# Altium schematic sheet Sheet2.SchDoc
size A; SheetNumber: 1; SheetTotal: 1
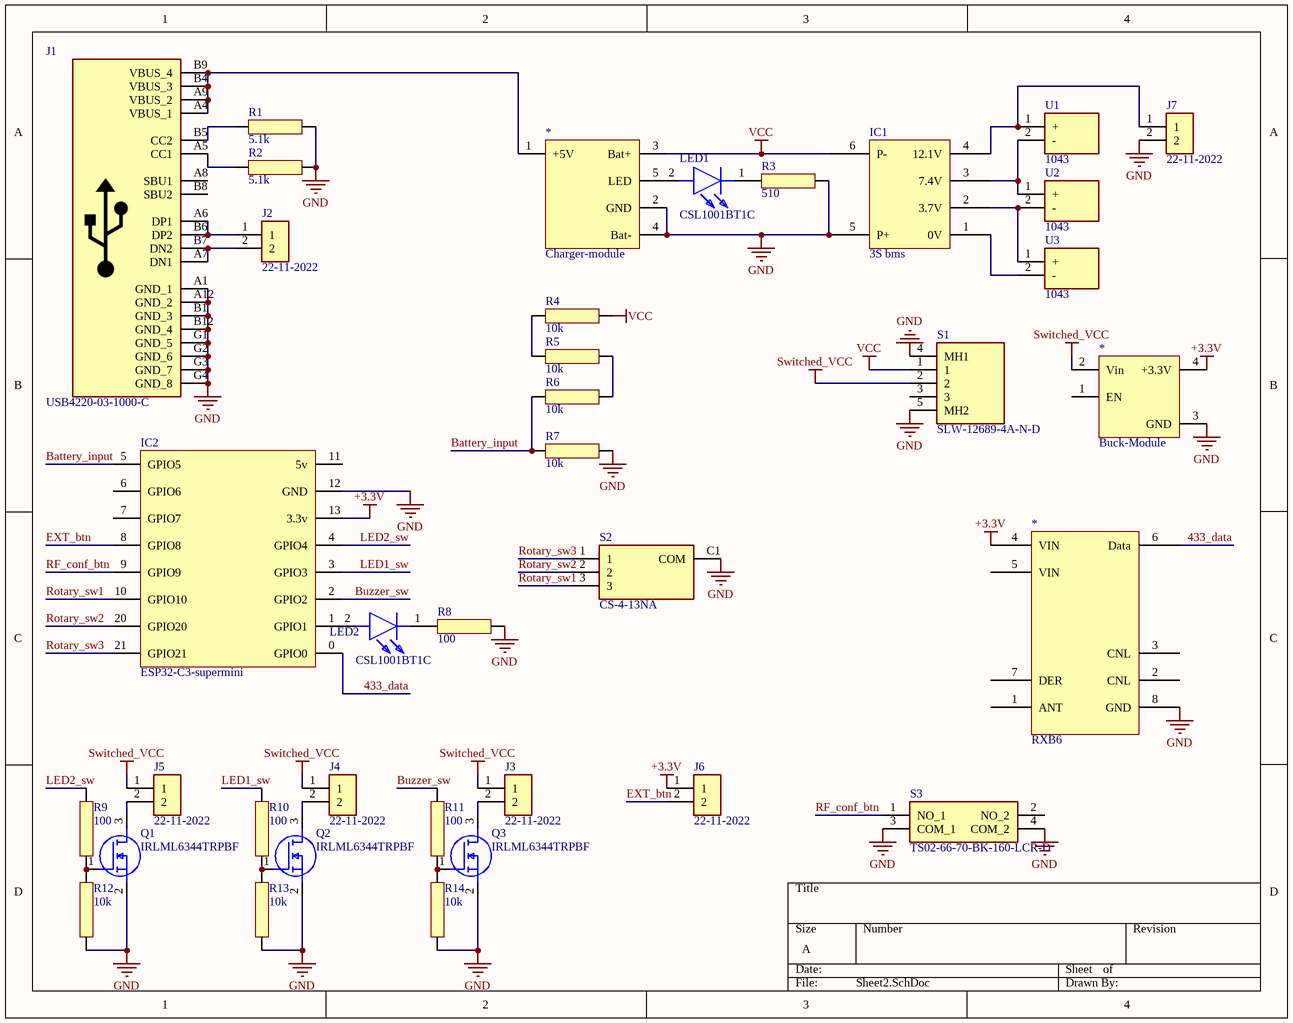
[diagram p0: Sheet2.SchDoc]

## Parts
(Parts that share a designator on the sheet are numbered #1, #2 ... from top to bottom, then left to right.)
*#1  Charger-module  [Charger-module]
*#2  Buck-Module  [Buck-Module]
*#3  RXB6  [RXB6]
IC1  3S bms  [3S BMS]
IC2  ESP32-C3-supermini  [Esp32Module]
J1  USB4220-03-1000-C  [USB4220031000C]
J2  22-11-2022  [22112022]
J3  22-11-2022  [22112022]
J4  22-11-2022  [22112022]
J5  22-11-2022  [22112022]
J6  22-11-2022  [22112022]
J7  22-11-2022  [22112022]
LED1  CSL1001BT1C  [CSL1001BT1C]
LED2  CSL1001BT1C  [CSL1001BT1C]
Q1  IRLML6344TRPBF  [SOT95P237X112-3N]
Q2  IRLML6344TRPBF  [SOT95P237X112-3N]
Q3  IRLML6344TRPBF  [SOT95P237X112-3N]
R1  5.1k  [Resistor]
R2  5.1k  [Resistor]
R3  510  [Resistor]
R4  10k  [Resistor]
R5  10k  [Resistor]
R6  10k  [Resistor]
R7  10k  [Resistor]
R8  100  [Resistor]
R9  100  [Resistor]
R10  100  [Resistor]
R11  100  [Resistor]
R12  10k  [Resistor]
R13  10k  [Resistor]
R14  10k  [Resistor]
S1  SLW-12689-4A-N-D  [SLW126894AND]
S2  CS-4-13NA  [CS413NA]
S3  TS02-66-70-BK-160-LCR-D  [TS026670BK160LCRD]
U1  1043  [1043]
U2  1043  [1043]
U3  1043  [1043]

## Nets
+3.3V: *#2.4(+3.3V) *#3.4(VIN) IC2.13(3.3v) J6.1
GND: *#1.2(GND) *#1.4(Bat-) *#2.3(GND) *#3.8(GND) IC1.5(P+) IC2.12(GND) J1.A1(GND_1) J1.A12(GND_2) J1.B1(GND_3) J1.B12(GND_4) J1.G1(GND_5) J1.G2(GND_6) J1.G3(GND_7) J1.G4(GND_8) J7.2 Q1.2(S) Q2.2(S) Q3.2(S) R1.2 R2.2 R3.1 R7.2 R8.1 R12.1 R13.1 R14.1 S1.4(MH1) S1.5(MH2) S2.C1(COM) S3.3(COM_1) S3.4(COM_2)
Switched_VCC: *#2.2(Vin) J3.1 J4.1 J5.1 S1.2
VCC: *#1.3(Bat+) IC1.6(P-) R4.2 S1.1
433_data: *#3.6(Data) IC2.0(GPIO0)
Battery_input: IC2.5(GPIO5) R6.1 R7.1
Buzzer_sw: IC2.2(GPIO2) R11.2
EXT_btn: IC2.8(GPIO8) J6.2
LED1_sw: IC2.3(GPIO3) R10.2
LED2_sw: IC2.4(GPIO4) R9.2
RF_conf_btn: IC2.9(GPIO9) S3.1(NO_1)
Rotary_sw1: IC2.10(GPIO10) S2.3
Rotary_sw2: IC2.20(GPIO20) S2.2
Rotary_sw3: IC2.21(GPIO21) S2.1
Net*#1_1: *#1.1(+5V) J1.A4(VBUS_1) J1.A9(VBUS_2) J1.B4(VBUS_3) J1.B9(VBUS_4)
Net*#1_5: *#1.5(LED) LED1.2(A)
NetIC1_1: IC1.1(0V) U3.2(-)
NetIC1_2: IC1.2(3.7V) U2.2(-) U3.1(+)
NetIC1_3: IC1.3(7.4V) U1.2(-) U2.1(+)
NetIC1_4: IC1.4(12.1V) J7.1 U1.1(+)
NetIC2_1: IC2.1(GPIO1) LED2.2(A)
NetJ1_A5: J1.A5(CC1) R2.1
NetJ1_A6: J1.A6(DP1) J1.B6(DP2) J2.1
NetJ1_A7: J1.A7(DN1) J1.B7(DN2) J2.2
NetJ1_B5: J1.B5(CC2) R1.1
NetJ3_2: J3.2 Q3.3(D)
NetJ4_2: J4.2 Q2.3(D)
NetJ5_2: J5.2 Q1.3(D)
NetLED1_1: LED1.1(K) R3.2
NetLED2_1: LED2.1(K) R8.2
NetQ1_1: Q1.1(G) R9.1 R12.2
NetQ2_1: Q2.1(G) R10.1 R13.2
NetQ3_1: Q3.1(G) R11.1 R14.2
NetR4_1: R4.1 R5.1
NetR5_2: R5.2 R6.2

Not connected (* = marked no-connect by the designer): *#2 1(EN); *#3 1(ANT) 2(CNL) 3(CNL) 5(VIN) 7(DER); IC2 6(GPIO6) 7(GPIO7) 11(5v); J1 A8(SBU1) B8(SBU2); S1 3; S3 2(NO_2)

## Library data of the parts
J1 = USB4220-03-1000-C: Connector; Manufacturer_Name: GCT (GLOBAL CONNECTOR TECHNOLOGY); Datasheet Link: https://gct.co/download?type=PDFDrawing&name=USB4220.pdf; Height: 10.25mm; Manufacturer_Part_Number: USB4220-03-1000-C; Mouser Part Number: 640-USB4220031000C; Mouser Price/Stock: https://www.mouser.co.uk/ProductDetail/GCT/USB4220-03-1000-C?qs=iLKYxzqNS75fs1QrHcx%2FlA%3D%3D
J2-J7 = 22-11-2022: Connector; Manufacturer_Name: Molex; Datasheet Link: https://www.molex.com/en-us/products/part-detail/22112022?display=pdf; Height: 10.92mm; Manufacturer_Part_Number: 22-11-2022; Mouser Part Number: 538-22-11-2022; Mouser Price/Stock: https://www.mouser.co.uk/ProductDetail/Molex/22-11-2022?qs=mrPiglD9aYLq1NGrfjXTJg%3D%3D; Arrow Part Number: 22-11-2022; Arrow Price/Stock: https://www.arrow.com/en/products/22-11-2022/molex?utm_currency=USD&region=nac
LED1 LED2 = CSL1001BT1C: LED; Manufacturer_Name: ROHM Semiconductor; Datasheet Link: https://fscdn.rohm.com/en/products/databook/datasheet/opto/led/chip_mono/csl1001bt1(c)-e.pdf; Height: 1.16mm; Manufacturer_Part_Number: CSL1001BT1C; Mouser Part Number: 755-CSL1001BT1C; Mouser Price/Stock: https://www.mouser.co.uk/ProductDetail/ROHM-Semiconductor/CSL1001BT1C?qs=HoCaDK9Nz5fqNTX3Pg0ReA%3D%3D
Q1-Q3 = IRLML6344TRPBF: MOSFET (N-Channel); Manufacturer_Name: Infineon; Datasheet Link: https://www.infineon.com/dgdl/irlml6344pbf.pdf?fileId=5546d462533600a4015356689c44262c; Height: 1.12mm; Manufacturer_Part_Number: IRLML6344TRPBF; Mouser Part Number: 942-IRLML6344TRPBF; Mouser Price/Stock: https://www.mouser.co.uk/ProductDetail/Infineon-Technologies/IRLML6344TRPBF?qs=9%252BKlkBgLFf2w4qS48UOXVw%3D%3D; Arrow Part Number: IRLML6344TRPBF; Arrow Price/Stock: https://www.arrow.com/en/products/irlml6344trpbf/infineon-technologies-ag?utm_currency=USD&region=europe
R1-R14 = Resistor
S1 = SLW-12689-4A-N-D: Switch; Manufacturer_Name: Same Sky; Datasheet Link: https://www.sameskydevices.com/product/resource/SLW-12689-4A-N-D.pdf; Height: 10.3mm; Manufacturer_Part_Number: SLW-12689-4A-N-D; Mouser Part Number: 179-SLW126894AND; Mouser Price/Stock: https://www.mouser.co.uk/ProductDetail/Same-Sky/SLW-12689-4A-N-D?qs=IKkN%2F947nfDDpe%2FKbSKjtQ%3D%3D; Arrow Part Number: SLW-12689-4A-N-D; Arrow Price/Stock: https://www.arrow.com/en/products/slw-12689-4a-n-d/cui-devices?utm_currency=USD&region=nac
S2 = CS-4-13NA: Switch; Manufacturer_Name: Nidec Copal; Datasheet Link: https://www.nidec-components.com/e/catalog/switch/cs-4.pdf; Height: 2.6mm; Manufacturer_Part_Number: CS-4-13NA; Mouser Part Number: 229-CS-4-13NA; Mouser Price/Stock: https://www.mouser.co.uk/ProductDetail/Nidec-Components/CS-4-13NA?qs=XeJtXLiO41RevovLKa6Aew%3D%3D
S3 = TS02-66-70-BK-160-LCR-D: Switch; Manufacturer_Name: Same Sky; Datasheet Link: https://www.sameskydevices.com/product/resource/TS02-66-70-BK-160-LCR-D.pdf; Height: 7.2mm; Manufacturer_Part_Number: TS02-66-70-BK-160-LCR-D; Mouser Part Number: 179-TS026670BK160LCR; Mouser Price/Stock: https://www.mouser.co.uk/ProductDetail/CUI-Devices/TS02-66-70-BK-160-LCR-D?qs=A6eO%252BMLsxmSQ8aVkS4Cu7Q%3D%3D; Arrow Part Number: TS02-66-70-BK-160-LCR-D; Arrow Price/Stock: https://www.arrow.com/en/products/ts02-66-70-bk-160-lcr-d/cui-devices?region=nac
U1-U3 = 1043: Undefined or Miscellaneous; Manufacturer_Name: Keystone Electronics; Datasheet Link: http://www.keyelco.com/product-pdf.cfm?p=919; Manufacturer_Part_Number: 1043; Mouser Part Number: 534-1043; Mouser Price/Stock: https://www.mouser.co.uk/ProductDetail/Keystone-Electronics/1043?qs=%2F7TOpeL5Mz6j%2FnxeOA1rsg%3D%3D; Arrow Part Number: 1043; Arrow Price/Stock: https://www.arrow.com/en/products/1043/keystone-electronics?utm_currency=USD&region=europe